# EAGLE schematic Terminierung_RS485_RJ45 (EAGLE 8.5.1)
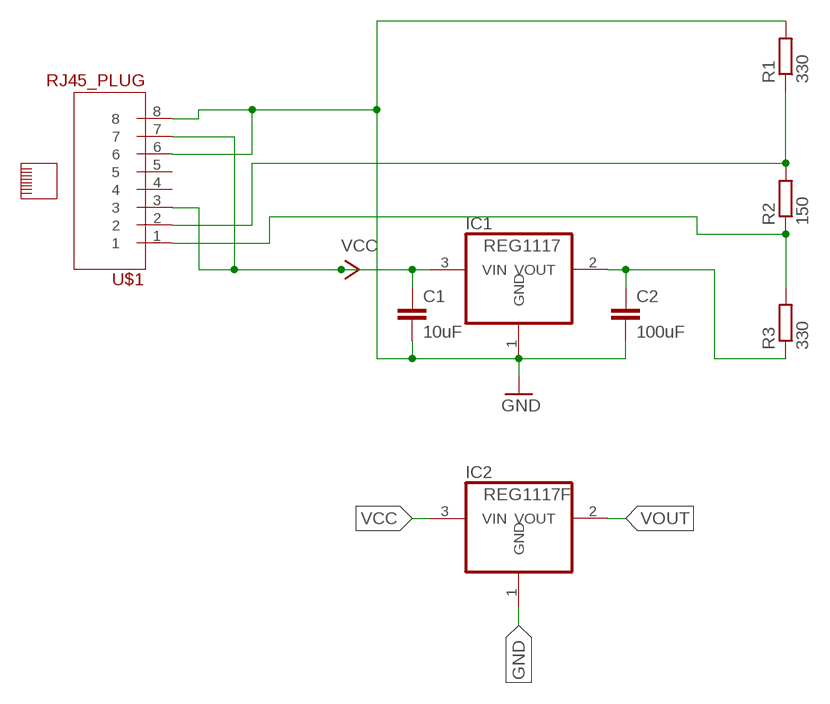
[diagram p0: schematic, sheet 1]

## Parts
C1  10uF  C-EUC0805K  [C0805K]
C2  100uF  C-EUC0805K  [C0805K]
IC1  REG1117  [SOT223]
IC2  REG1117F  [DD-3]
R1  330  R-EU_R0805  [R0805]
R2  150  R-EU_R0805  [R0805]
R3  330  R-EU_R0805  [R0805]
U$1  RJ45_PLUG  [RJ45_PLUG]

## Nets
GND: C1.2 C2.2 IC1.1(GND) IC2.1(GND) R1.2 U$1.6 U$1.8
N$3: R1.1 R2.2 U$1.2
N$4: R2.1 R3.2 U$1.1
VCC: C1.1 IC1.3(VIN) IC2.3(VIN) U$1.3 U$1.7
VOUT: C2.1 IC1.2(VOUT) IC2.2(VOUT) R3.1
Unconnected: U$1.4 U$1.5

## Library data of the parts
C1 C2 = resistor:C-EU: CAPACITOR, European symbol
IC1 = burr-brown:REG1117: 800mA and 1A Low Dropout (LDO) Positive Regulator 1.8V, 2.5V, 2.85V, 3.3V, 5V, and Adj; MPN: REG1117; OC_FARNELL: 1097566; OC_NEWARK: 14P6981
IC2 = burr-brown:REG1117: 800mA and 1A Low Dropout (LDO) Positive Regulator 1.8V, 2.5V, 2.85V, 3.3V, 5V, and Adj; MF: TEXAS INSTRUMENTS; MPN: REG1117FAKTTT; OC_FARNELL: 1296120; OC_NEWARK: 87H2562
R1-R3 = resistor:R-EU_: RESISTOR, European symbol
U$1 = MetzConnect_RJ45_Plug:RJ45_PLUG